# EAGLE design BM2Step V1.0 (EAGLE 8.6.0)
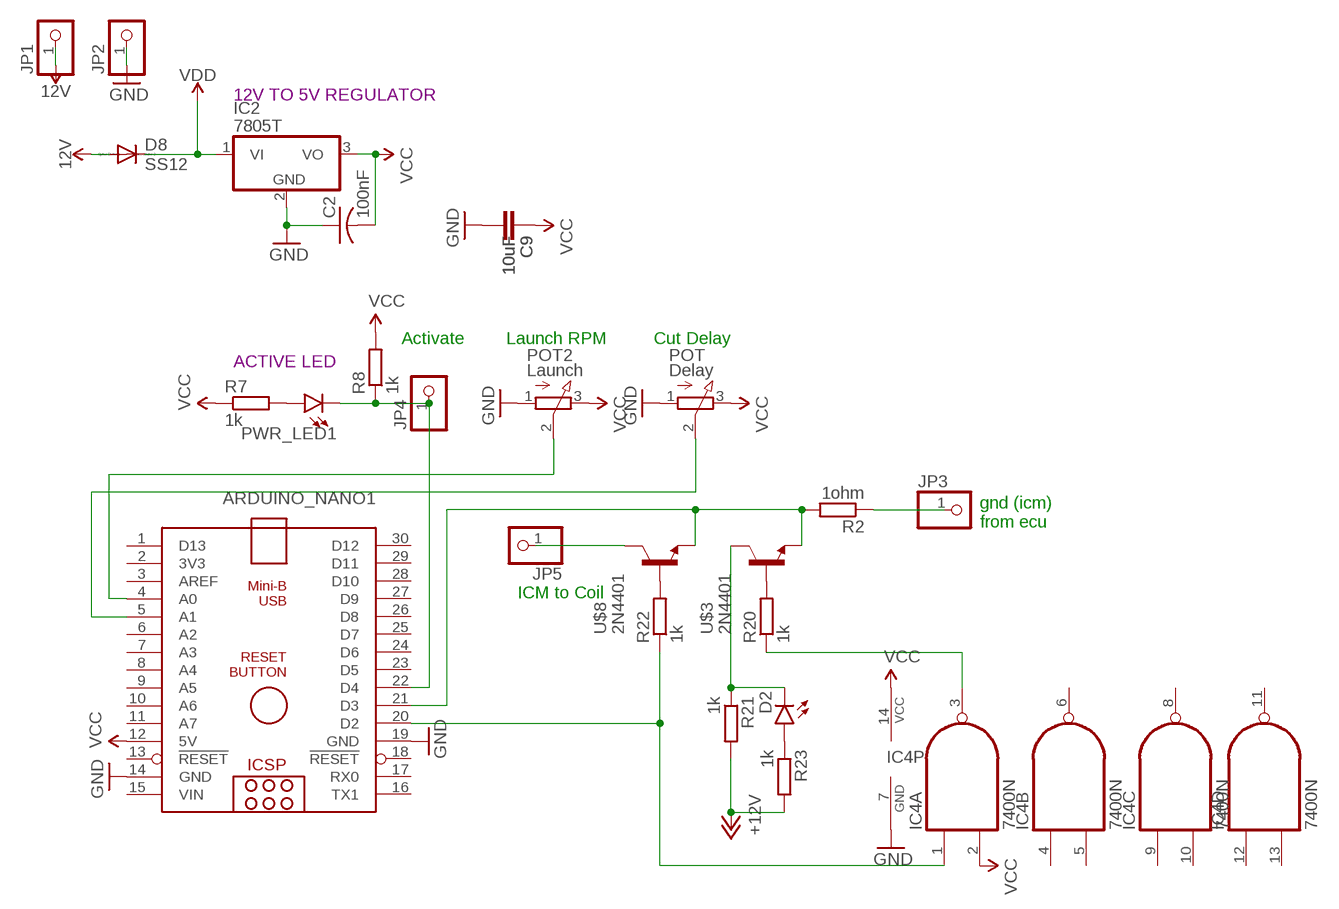
[diagram p0: schematic, sheet 1]

## Parts
ARDUINO_NANO1  ARDUINO_NANO  [ARDUINO_NANO]
C2  100nF  C-US025-024X044  [C025-024X044]
C9  10uF  CAP_  [AXIAL-5MM]
D2  LED3MM  [LED3MM]
D8  SS12  DIODE-D-7.5  [D-7.5]
IC2  7805T  [TO220H]
IC4  7400N  [DIL14]
JP1  PINHD-1X1_LARGE  [1X01_LARGE]
JP2  PINHD-1X1_LARGE  [1X01_LARGE]
JP3  PINHD-1X1_LARGE  [1X01_LARGE]
JP4  PINHD-1X1_LARGE  [1X01_LARGE]
JP5  PINHD-1X1_LARGE  [1X01_LARGE]
POT  Delay  EVUF2A  [EVUF]
POT2  Launch  EVUF2A  [EVUF]
PWR_LED1  LED3MM  [LED_3MM]
R2  1ohm  R-EU_0204/7  [0204/7]
R7  1k  R-EU_0204/7  [0204/7]
R8  1k  R-EU_0204/7  [0204/7]
R20  1k  R-EU_0204/7  [0204/7]
R21  1k  R-EU_0204/7  [0204/7]
R22  1k  R-EU_0204/7  [0204/7]
R23  1k  R-EU_0204/7  [0204/7]
U$3  2N4401  2SC458  [TO92-ECB]
U$8  2N4401  2SC458  [TO92-ECB]

## Nets
12V: D8.A JP1.1
+12V: R21.2 R23.2
GND: ARDUINO_NANO1.14(GND) ARDUINO_NANO1.19(GND) C2.1 C9.P$2 IC2.2(GND) IC4.7(P:GND) JP2.1 POT2.1(A) POT.1(A)
N$7: IC4.3(A:O) R20.1
N$9: ARDUINO_NANO1.22(D4) JP4.1 PWR_LED1.K(C) R8.1
N$15: ARDUINO_NANO1.4(A0) POT2.2(S)
N$18: ARDUINO_NANO1.5(A1) POT.2(S)
N$19: JP3.1 R2.1
N$29: ARDUINO_NANO1.21(D3) R2.2 U$3.E U$8.E
N$34: PWR_LED1.A R7.2
N$45: R20.2 U$3.B
N$62: D2.K(C) R21.1 U$3.C
N$64: JP5.1 U$8.C
N$65: R22.2 U$8.B
N$66: ARDUINO_NANO1.20(D2) IC4.1(A:I0) R22.1
N$82: D2.A R23.1
VCC: ARDUINO_NANO1.12(5V) C2.2 C9.P$1 IC2.3(VO) IC4.2(A:I1) IC4.14(P:VCC) POT2.3(E) POT.3(E) R7.1 R8.2
VDD: D8.C IC2.1(VI)
Unconnected: ARDUINO_NANO1.1(D13) ARDUINO_NANO1.2(3V3) ARDUINO_NANO1.3(AREF) ARDUINO_NANO1.6(A2) ARDUINO_NANO1.7(A3) ARDUINO_NANO1.8(A4) ARDUINO_NANO1.9(A5) ARDUINO_NANO1.10(A6) ARDUINO_NANO1.11(A7) ARDUINO_NANO1.13(!RESET) ARDUINO_NANO1.16(TX1) ARDUINO_NANO1.17(RX0) ARDUINO_NANO1.18(!RESET) ARDUINO_NANO1.23(D5) ARDUINO_NANO1.24(D6) ARDUINO_NANO1.25(D7) ARDUINO_NANO1.26(D8) ARDUINO_NANO1.27(D9) ARDUINO_NANO1.28(D10) ARDUINO_NANO1.29(D11) ARDUINO_NANO1.30(D12) IC4.4(B:I0) IC4.5(B:I1) IC4.6(B:O) IC4.8(C:O) IC4.9(C:I0) IC4.10(C:I1) IC4.11(D:O) IC4.12(D:I0) IC4.13(D:I1)

## Notes on the sheet
- 12V TO 5V REGULATOR
- Activate | Launch RPM | Cut Delay
- ACTIVE LED
- gnd (icm)
  from ecu
- ICM to Coil

## Power pins joined to a net without a drawn wire
VIN: ARDUINO_NANO1.15(VIN)

## Library data of the parts
ARDUINO_NANO1 = ArduinoNanoV30:ARDUINO_NANO: Arduino Nano V3.0 Overview: The Arduino Nano is a small, complete, and breadboard-friendly board based on the ATmega328 (Arduino Nano 3.x) or ATmega168 (Arduino Nano 2.x). It has more or less the same functionality of the Arduino Duemilanove, but in a different package. It lacks only a DC power jack, and works with a Mini-B USB cable instead of a standard one. The Nano was designed and is being produced by Gravitech. Specifications: Microcontroller Atmel ATmega168 or ATmega328 Operating Voltage (logic level) 5 V Input Voltage (recommended) 7-12 V Input Voltage (limits) 6-20 V Digital I/O Pins 14 (of which 6 provide PWM output) Analog Input Pins 8 DC Current per I/O Pin 40 mA Flash Memory 16 KB (ATmega168) or 32 KB (ATmega328) of which 2 KB used by bootloader SRAM 1 KB (ATmega168) or 2 KB (ATmega328) EEPROM 512 bytes (ATmega168) or 1 KB (ATmega328) Clock Speed 16 MHz Dimensions 0.73" x 1.70" Length 45 mm Width 18 mm Weigth 5 g Power: The Arduino Nano can be powered via the Mini-B USB connection, 6-20V unregulated external power supply (pin 30), or 5V regulated external power supply (pin 27). The power source is automatically selected to the highest voltage source. Memory: The ATmega168 has 16 KB of flash memory for storing code (of which 2 KB is used for the bootloader); the ATmega328 has 32 KB, (also with 2 KB used for the bootloader). The ATmega168 has 1 KB of SRAM and 512 bytes of EEPROM (which can be read and written with the EEPROM library); the ATmega328 has 2 KB of SRAM and 1 KB of EEPROM. Input and Output: Each of the 14 digital pins on the Nano can be used as an input or output, using pinMode(), digitalWrite(), and digitalRead() functions. They operate at 5 volts. Each pin can provide or receive a maximum of 40 mA and has an internal pull-up resistor (disconnected by default) of 20-50 kOhms. In addition, some pins have specialized functions. Visit Arduino - ArduinoBoardNano <https://www.arduino.cc/en/Main/ArduinoBoardNano>
C2 = resistor:C-US: CAPACITOR, American symbol
C9 = SparkFun:CAP: Capacitor Standard 0603 ceramic capacitor, and 0.1" leaded capacitor.
D2 = led:LED: LED OSRAM: - CHIPLED LG R971, LG N971, LY N971, LG Q971, LY Q971, LO R971, LY R971 LH N974, LH R974 LS Q976, LO Q976, LY Q976 LO Q996 - Hyper CHIPLED LW Q18S LB Q993, LB Q99A, LB R99A - SideLED LS A670, LO A670, LY A670, LG A670, LP A670 LB A673, LV A673, LT A673, LW A673 LH A674 LY A675 LS A676, LA A676, LO A676, LY A676, LW A676 LS A679, LY A679, LG A679 - Hyper Micro SIDELED® LS Y876, LA Y876, LO Y876, LY Y876 LT Y87S - SmartLED LW L88C, LW L88S LB L89C, LB L89S, LG L890 LS L89K, LO L89K, LY L89K LS L896, LA L896, LO L896, LY L896 - TOPLED LS T670, LO T670, LY T670, LG T670, LP T670 LSG T670, LSP T670, LSY T670, LOP T670, LYG T670 LG T671, LOG T671, LSG T671 LB T673, LV T673, LT T673, LW T673 LH T674 LS T676, LA T676, LO T676, LY T676, LB T676, LH T676, LSB T676, LW T676 LB T67C, LV T67C, LT T67C, LS T67K, LO T67K, LY T67K, LW E67C LS E67B, LA E67B, LO E67B, LY E67B, LB E67C, LV E67C, LT E67C LW T67C LS T679, LY T679, LG T679 LS T770, LO T770, LY T770, LG T770, LP T770 LB T773, LV T773, LT T773, LW T773 LH T774 LS E675, LA E675, LY E675, LS T675 LS T776, LA T776, LO T776, LY T776, LB T776 LHGB T686 LT T68C, LB T68C - Hyper Mini TOPLED® LB M676 - Mini TOPLED Santana® LG M470 LS M47K, LO M47K, LY M47K Source: http://www.osram.convergy.de LUXEON: - LUMILED® LXK2-PW12-R00, LXK2-PW12-S00, LXK2-PW14-U00, LXK2-PW14-V00 LXK2-PM12-R00, LXK2-PM12-S00, LXK2-PM14-U00 LXK2-PE12-Q00, LXK2-PE12-R00, LXK2-PE12-S00, LXK2-PE14-T00, LXK2-PE14-U00 LXK2-PB12-K00, LXK2-PB12-L00, LXK2-PB12-M00, LXK2-PB14-N00, LXK2-PB14-P00, LXK2-PB14-Q00 LXK2-PR12-L00, LXK2-PR12-M00, LXK2-PR14-Q00, LXK2-PR14-R00 LXK2-PD12-Q00, LXK2-PD12-R00, LXK2-PD12-S00 LXK2-PH12-R00, LXK2-PH12-S00 LXK2-PL12-P00, LXK2-PL12-Q00, LXK2-PL12-R00 Source: www.luxeon.com KINGBRIGHT: KA-3528ASYC Source: www.kingbright.com
D8 = diode:DIODE-: DIODE
IC2 = linear:78*: Positive VOLTAGE REGULATOR Source: http://cache.national.com/ds/LM/LM78L05.pdf http://www.fairchildsemi.com/ds/LM/LM7805.pdf
IC4 = 74xx-us_MOD:74*00: Quad 2-input NAND gate
JP1-JP5 = pinhead_MOD:PINHD-1X1_LARGE: PIN HEADER
POT POT2 = pot:EVU: 9 mm Square Rotary Potentiometers Source: Panasonic
PWR_LED1 = SparkFun-LED:LED: LED (Generic) Standard schematic elements and footprints for 5mm, 3mm, 1206, and 0603 sized LEDs. Generic LEDs with no color specified.; PROD_ID: DIO-08794
R2 R7 R8 R20-R23 = resistor:R-EU_: RESISTOR, European symbol
U$3 U$8 = transistor:2SC458: NPN Silicon Epitaxial Planar Transistor Source: SEMTECH ELECTRONICS LTD. ... 2SC458 1.pdf

## Net classes
3 usbvcc: width 0.508 mm, drill 0.61 mm, clearance 0.254 mm

## Board
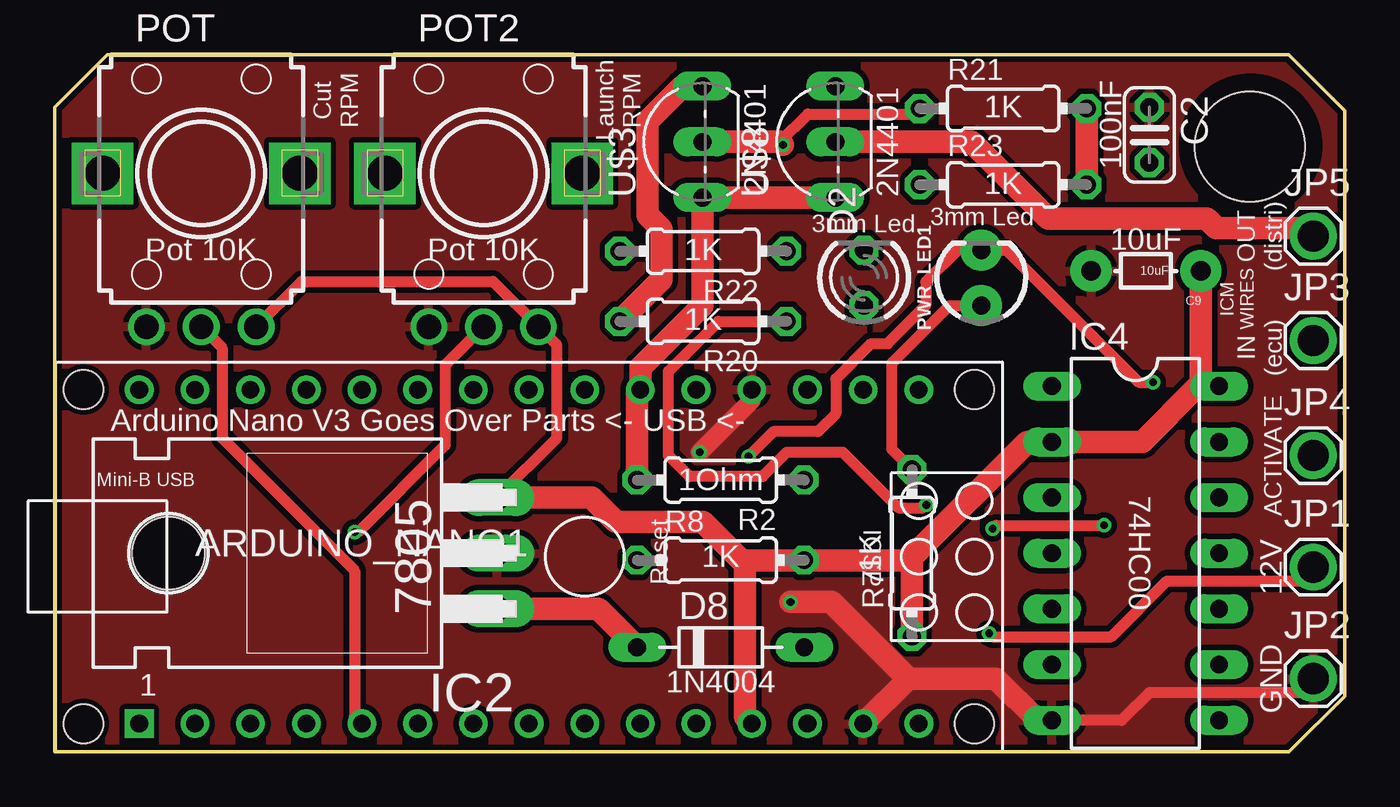
[diagram p1: board, top side]
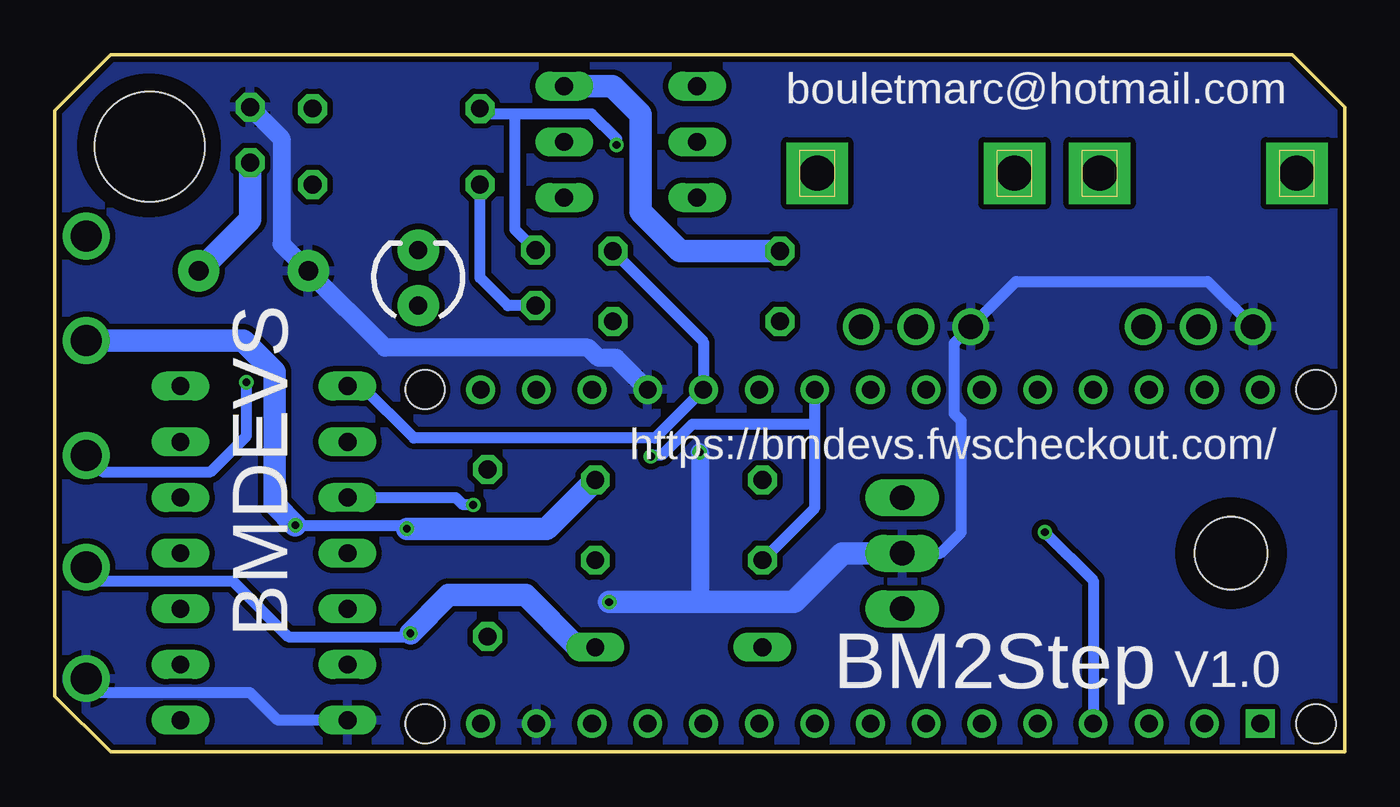
[diagram p2: board, bottom side, seen from below]

Size 58.83 x 31.8 mm. Coordinates in mm from the lower left corner, seen from the top.
Outline: 0,0 0,29.41 2.38,31.8 56.29,31.8 58.83,29.26 58.83,2.54 56.29,0 0,0
Copper layers (1*16): Top 0.035mm / dielectric 1.5mm / Bottom 0.035mm
Design rules "BMBurner_Rules *": minimum track width 10mil, minimum drill 12mil, track to track 10mil, track to pad 10mil, pad to pad 10mil, via to via 10mil, smd to smd 0mil, copper to edge 10mil, drill to drill 10mil, minimum pad ring 10mil, minimum via ring 6mil, stop-mask expansion 2mil, vias tented up to drill 25mil, thermal gap 10mil
Holes 5 mm at 54.5,27.61
tRestrict: area 52.5,25.7 to 56.5,29.7
bRestrict: area -18.4,74.4 to -9.7,78.1; area 52.5,25.7 to 56.5,29.7

### Footprints (pad centres in the part's own frame; a part is rotated, then mirrored left to right if it is on the bottom)
ARDUINO_NANO = drill 0.8 square: 1 -20.32,-7.62 | drill 0.8: 2 -17.78,-7.62; 3 -15.24,-7.62; 4 -12.7,-7.62; 5 -10.16,-7.62; 6 -7.62,-7.62; 7 -5.08,-7.62; 8 -2.54,-7.62; 9 0,-7.62; 10 2.54,-7.62; 11 5.08,-7.62; 12 7.62,-7.62; 13 10.16,-7.62; 14 12.7,-7.62; 15 15.24,-7.62; 16 15.24,7.62; 17 12.7,7.62; 18 10.16,7.62; 19 7.62,7.62; 20 5.08,7.62; 21 2.54,7.62; 22 0,7.62; 23 -2.54,7.62; 24 -5.08,7.62; 25 -7.62,7.62; 26 -10.16,7.62; 27 -12.7,7.62; 28 -15.24,7.62; 29 -17.78,7.62; 30 -20.32,7.62 | hole 1.778: -22.86,-7.62; -22.86,7.62; 17.78,7.62; 17.78,-7.62
C025-024X044 = drill 0.813 octagon: 1 -1.27,0; 2 1.27,0
AXIAL-5MM = drill 0.9 pad 1.88: P$1 -2.5,0; P$2 2.5,0
LED3MM = drill 0.813 octagon: A -1.27,0; K 1.27,0
D-7.5 = drill 0.813 long: A 3.81,0; C -3.81,0
TO220H = drill 1.118 long: 1 -2.54,-10.16; 2 0,-10.16; 3 2.54,-10.16 | hole 3.302: 0,4.826
DIL14 = drill 0.813 long: 1 -7.62,-3.81; 2 -5.08,-3.81; 3 -2.54,-3.81; 4 0,-3.81; 5 2.54,-3.81; 6 5.08,-3.81; 7 7.62,-3.81; 8 7.62,3.81; 9 5.08,3.81; 10 2.54,3.81; 11 0,3.81; 12 -2.54,3.81; 13 -5.08,3.81; 14 -7.62,3.81
1X01_LARGE = drill 1.422: 1 0,0
EVUF = drill 1.1 pad 1.676: 1 -2.5,-7; 2 0,-7; 3 2.5,-7 | drill 1.6 pad 2.8 square: M1 4.5,0; M2 -4.5,0
LED_3MM = drill 0.813 pad 1.88: A -1.27,0; K 1.27,0
0204/7 = drill 0.813 octagon: 1 -3.81,0; 2 3.81,0
TO92-ECB = drill 0.813 long: B 2.54,0; C 0,0; E -2.54,0

### Placement (x,y rotation side)
ARDUINO_NANO1  24.17,8.9 0 top
C2  49.93,28.14 270 top
C9  49.77,21.94 180 top
D2  36.91,21.63 90 top
D8  30.37,4.77 0 top
IC2  10.02,9.06 90 top
IC4  49.29,9.06 270 top
JP1  57.4,8.43 0 top
JP2  57.4,3.34 0 top
JP3  57.4,18.76 0 top
JP4  57.4,13.52 0 top
JP5  57.4,23.53 0 top
POT  6.68,26.39 0 top
POT2  19.56,26.39 0 top
PWR_LED1  42.25,21.63 90 top
R2  30.37,12.4 180 top
R7  39.09,9.07 90 top
R8  30.37,8.74 0 top
R20  29.57,19.64 180 top
R21  43.25,29.35 0 top
R22  29.57,22.84 180 top
R23  43.25,25.87 0 top
U$3  29.54,27.83 90 top
U$8  35.6,27.83 90 top

### Tracks (layer width: path | path; a pad name or v marks a point on that pad's centre or on a via)
12V  (via drill 0.35)
  Top 0.508: v42.61,5.41 42.77,5.25 48.18,5.25 50.72,7.79 56.76,7.79 JP1.1
  Bottom 0.508: JP1.1 56.76,7.79 50.72,7.79 48.18,5.25 42.77,5.25 v42.61,5.41
  Bottom 1.016: D8.A 34.98,4.77 37.37,7.16 40.86,7.16 v42.61,5.41
+12V
  Top 1.016: R23.2 R21.2
GND  (via drill 0.35)
  Top 0.508: JP2.1 56.76,2.7 49.93,2.7 48.65,1.43 45.49,1.43 IC4.7
  Top 0.813: ARDUINO_NANO1.19 31.79,16.05 v29.41,13.67
  Top 1.016: IC4.7 44.83,1.44 42.93,3.34 38.92,3.34 | 38.92,3.34 ARDUINO_NANO1.14 | 38.92,3.34 35.42,6.84 v33.55,6.84
  Bottom 0.508: IC4.7 48.67,1.44 49.93,2.7 56.76,2.7 JP2.1 | IC2.2 18.44,9.06 17.49,10.02 17.49,15.11 17.81,15.42 17.81,18.64 POT2.1 14.99,21.46 6.25,21.46 POT.1
  Bottom 0.813: C2.1 48.49,27.98 48.49,23.17 C9.P$2 43.77,18.44 34.5,18.44 34.03,17.97 33.23,17.97 ARDUINO_NANO1.19 | v29.41,13.67 29.41,7 29.57,6.84
  Bottom 1.016: v33.55,6.84 29.57,6.84 25.12,6.84 22.9,9.06 IC2.2
  pour Bottom: -0.16,31.96 59.15,31.96 59.15,0 -0.16,0
  pour Top: -0.16,31.96 59.15,31.96 59.15,0 -0.16,0
N$7  (via drill 0.35)
  Top 0.508: v39.75,11.27 39.62,11.13 38.48,11.13 35.93,13.67 33.39,13.67 32.28,12.56 28.94,12.56 27.98,13.52 27.98,17.36 30.26,19.64 R20.1
  Bottom 0.508: 46.27,11.6 IC4.3 40.55,11.6 40.21,11.27 v39.75,11.27
N$9  (via drill 0.35)
  Top 0.508: v50.09,16.85 49.45,16.85 43.41,22.9 PWR_LED1.K 41.18,22.9 39.73,21.45 39.73,20.37 37.98,18.62 37.23,18.62 35.62,17.01 35.62,15.42 34.8,14.61 32.77,14.61 v31.64,13.47
  Bottom 0.508: JP4.1 56.66,12.77 51.73,12.77 50.09,14.42 v50.09,16.85 | 24.17,14.95 ARDUINO_NANO1.22 | 26.91,8.74 R8.1 24.17,11.14 24.17,14.95 | v31.64,13.47 31.57,13.55 31.15,13.55 29.75,14.95 24.17,14.95
N$15  (via drill 0.35)
  Top 0.508: POT2.2 17.81,17.64 17.81,13.99 13.83,10.02 v13.67,10.02
  Bottom 0.508: v13.67,10.02 11.47,7.81 ARDUINO_NANO1.4
N$18
  Top 0.508: POT.2 7.63,18.44 7.63,14.31 13.67,8.27 13.67,1.62 ARDUINO_NANO1.5
N$19  (via drill 0.35)
  Top 0.508: v42.77,10.18 42.93,10.34 v47.86,10.34
  Bottom 0.508: v42.77,10.18 42.93,10.34 v47.86,10.34
  Bottom 1.016: R2.1 36.41,10.18 v42.77,10.18 | v47.86,10.34 48.81,11.29 48.81,17.33 50.24,18.76 JP3.1
N$29
  Top 1.016: R2.2 26.56,16.38 ARDUINO_NANO1.21 26.71,17.52 29.54,20.35 U$3.E U$8.E
N$34
  Top 0.508: PWR_LED1.A 40.79,20.36 38.16,17.72 38.16,13.81 R7.2
N$45
  Top 1.016: R20.2 27.67,21.55 27.67,23.85 27.03,24.49 27.03,28.78 28.62,30.37 U$3.B
N$62  (via drill 0.35)
  Top 0.508: 33.08,27.83 34.34,29.1 39.19,29.1 R21.1
  Top 1.016: U$3.C 33.08,27.83 v33.21,27.7
  Bottom 0.508: v33.21,27.7 33.21,27.96 34.34,29.1 37.84,29.1 | 37.84,29.1 39.19,29.1 R21.1 | D2.K 37.84,23.83 37.84,29.1
N$64
  Top 1.016: U$8.C 41.81,27.83 45.31,24.33 52.53,24.33 52.97,23.89 57.04,23.89 JP5.1
N$65
  Bottom 1.016: R22.2 30.31,22.84 32.12,24.64 32.12,29.1 33.39,30.37 U$8.B
N$66
  Bottom 0.508: IC4.1 44.83,16.68 42.45,14.31 31.46,14.31 ARDUINO_NANO1.20 29.25,18.71 R22.1
N$82
  Bottom 0.508: D2.A 38.16,20.36 39.44,21.64 R23.1
VCC
  Top 0.508: IC2.3 22.9,14.32 22.9,18.55 POT2.3 19.99,21.46 11.25,21.46 POT.3
  Top 1.016: 52.14,16.68 IC4.14 | 52.14,16.68 49.6,14.14 IC4.2 44.35,14.14 39.09,8.88 | C9.P$1 52.27,16.81 52.14,16.68 | IC2.3 24.49,11.6 25.6,10.49 29.57,10.49 31.32,8.74 | ARDUINO_NANO1.12 31.48,1.59 31.48,8.59 31.32,8.74 | 39.09,8.88 38.95,8.74 R8.2 31.32,8.74 | R7.1 39.09,8.88
  Bottom 1.016: C9.P$1 49.93,24.28 C2.2
VDD
  Top 1.016: IC2.1 24.81,6.52 D8.C

### Text on the board
_tsilk: Cut / RPM | Launch / RPM | 1K | 100nF | 2N4401 | 2N4401 | 1K | 3mm Led | 3mm Led | OUT / (distri) | 10uF | Pot 10K | Pot 10K | 1K | ICM / WIRES | 1K | IN / (ecu) | Arduino Nano V3 Goes Over Parts <- USB <- | ACTIVATE | 1Ohm | 7805 | 1K | 74HC00 | 1K | 12V | 1N4004 | GND
_bsilk: bouletmarc@hotmail.com | https://bmdevs.fwscheckout.com/ | BMDEVS | V1.0 | BM2Step